# EAGLE design WiFiSensorLTC3566 (EAGLE 7.7.0)
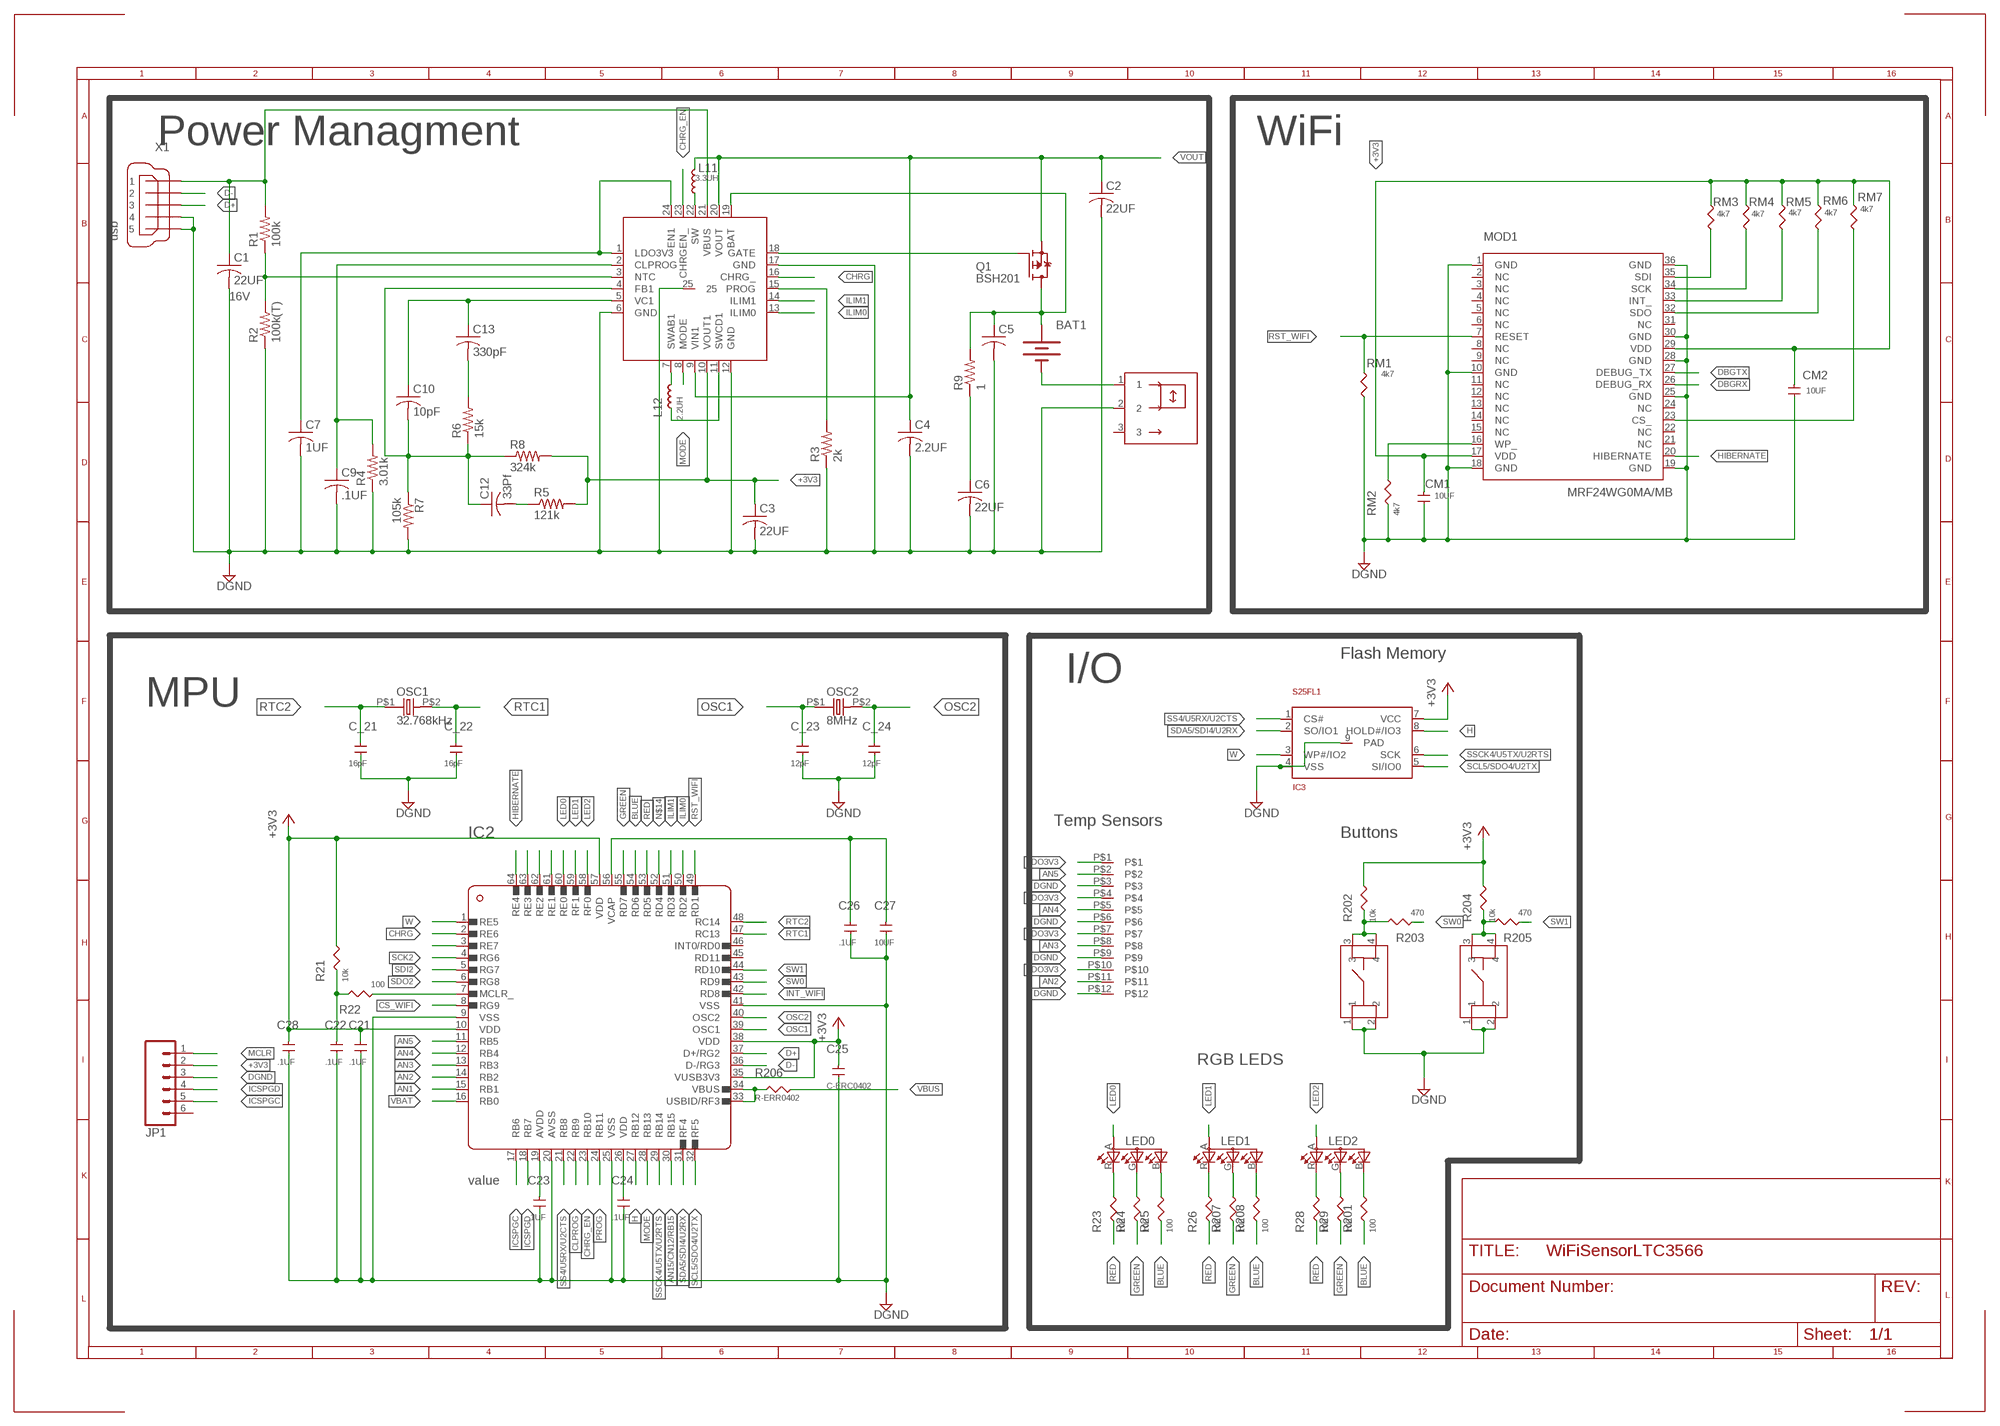
[diagram p0: schematic, sheet 1]

## Parts
BAT1  BATTERY245PTH  [BATTCON_245MM_PTH]
C1  22UF  C-USC0805  [C0805]
C2  22UF  C-USC0805  [C0805]
C3  22UF  C-USC0805  [C0805]
C4  2.2UF  C-USC0805  [C0805]
C5  C-USC0402  [C0402]
C6  22UF  C-USC0805  [C0805]
C7  1UF  C-USC0805  [C0805]
C9  .1UF  C-USC0402  [C0402]
C10  10pF  C-USC0402  [C0402]
C12  33Pf  C-USC0402  [C0402]
C13  330pF  C-USC0402  [C0402]
C21  .1UF  C-ERC0402  [C0402]
C22  .1UF  C-ERC0402  [C0402]
C23  .1UF  C-ERC0402  [C0402]
C24  .1UF  C-ERC0402  [C0402]
C25  C-ERC0402  [C0402]
C26  .1UF  C-ERC0402  [C0402]
C27  10UF  C-ER  [C0805]
C28  .1UF  C-ERC0402  [C0402]
C_21  16pF  C-ERC0402  [C0402]
C_22  16pF  C-ERC0402  [C0402]
C_23  12pF  C-ERC0402  [C0402]
C_24  12pF  C-ERC0402  [C0402]
CM1  10UF  C-ER  [C0805]
CM2  10UF  C-ER  [C0805]
IC1  LTC3566-2  LTC3566  [QFN24-4X4]
IC2  PICMX32695F512H  [TQFP64]
IC3  S25FL1  [8WSON]
JP1  M06LOCK  [1X06_LOCK]
JP2  12_127  [12-127]
L11  3.3UH  L-ERVLCF5020  [VLCF5020]
L12  2.2UH  L-ERVLCF5020  [VLCF5020]
LED0  1X1RGB  [1X1]
LED1  1X1RGB  [1X1]
LED2  1X1RGB  [1X1]
MOD1  MRF24WG0MA/MB  [MRF24]
OSC1  32.768kHz  ECX32  [ECX39]
OSC2  8MHz  CX532  [CX532]
Q1  BSH201  [SOT23]
R1  100k  R-US_R0402  [R0402]
R2  100k(T)  R-US_R0402  [R0402]
R3  2k  R-US_R0402  [R0402]
R4  3.01k  R-US_R0402  [R0402]
R5  121k  R-US_R0402  [R0402]
R6  15k  R-US_R0402  [R0402]
R7  105k  R-US_R0402  [R0402]
R8  324k  R-US_R0402  [R0402]
R9  1  R-US_R0402  [R0402]
R21  10k  R-ERR0402  [R0402]
R22  100  R-ERR0402  [R0402]
R23  100  R-ERR0402  [R0402]
R24  100  R-ERR0402  [R0402]
R25  100  R-ERR0402  [R0402]
R26  100  R-ERR0402  [R0402]
R28  100  R-ERR0402  [R0402]
R29  100  R-ERR0402  [R0402]
R201  100  R-ERR0402  [R0402]
R202  10k  R-ERR0402  [R0402]
R203  470  R-ERR0402  [R0402]
R204  10k  R-ERR0402  [R0402]
R205  470  R-ERR0402  [R0402]
R206  R-ERR0402  [R0402]
R207  100  R-ERR0402  [R0402]
R208  100  R-ERR0402  [R0402]
RM1  4k7  R-ERR0402  [R0402]
RM2  4k7  R-ERR0402  [R0402]
RM3  4k7  R-ERR0402  [R0402]
RM4  4k7  R-ERR0402  [R0402]
RM5  4k7  R-ERR0402  [R0402]
RM6  4k7  R-ERR0402  [R0402]
RM7  4k7  R-ERR0402  [R0402]
SW0  ADTS  [4X5]
SW1  ADTS  [4X5]
SW2  C&K_JS  [SAQN]
X1  usb  MINI-USB-UX60A-MB-5ST  [UX60A-MB-5ST]

## Nets
+3V3: C3.1 C21.2 C24.2 C25.2 C28.2 CM1.2 CM2.2 IC1.10(VOUT1) IC2.10(VDD) IC2.26(VDD) IC2.35(VUSB3V3) IC2.38(VDD) IC2.57(VDD) IC3.7(VCC) JP1.2 MOD1.17(VDD) MOD1.29(VDD) R5.2 R8.2 R21.2 R202.2 R204.2 RM3.2 RM4.2 RM5.2 RM6.2 RM7.2
AN1: IC2.15(RB1)
AN2: IC2.14(RB2) JP2.P$11
AN3: IC2.13(RB3) JP2.P$8
AN4: IC2.12(RB4) JP2.P$5
AN5: IC2.11(RB5) JP2.P$2
AN15/CN12/RB15: IC2.30(RB15)
BLUE: IC2.54(RD6) R25.1 R201.1 R208.1
CHRG: IC1.16(CHRG_) IC2.2(RE6)
CHRG_EN: IC1.23(CHRGEN_) IC2.23(RB10)
CLPROG: C9.1 IC1.2(CLPROG) IC2.22(RB9) R4.2
CS_WIFI: IC2.8(RG9) MOD1.23(CS_) RM7.1
D+: IC2.37(D+/RG2) X1.3
D-: IC2.36(D-/RG3) X1.2
DBGRX: MOD1.26(DEBUG_RX)
DBGTX: MOD1.27(DEBUG_TX)
DGND: C1.2 C2.2 C3.2 C4.2 C5.2 C6.2 C7.2 C9.2 C21.1 C22.1 C23.1 C24.1 C25.1 C26.1 C27.1 C28.1 C_21.1 C_22.1 C_23.1 C_24.1 CM1.1 CM2.1 IC1.6(GND) IC1.12(GND) IC1.17(GND) IC1.25 IC2.9(VSS) IC2.20(AVSS) IC2.25(VSS) IC2.41(VSS) IC3.4(VSS) IC3.9(PAD) JP1.3 JP2.P$3 JP2.P$6 JP2.P$9 JP2.P$12 MOD1.1(GND) MOD1.10(GND) MOD1.18(GND) MOD1.19(GND) MOD1.25(GND) MOD1.28(GND) MOD1.30(GND) MOD1.36(GND) R2.1 R3.1 R4.1 R7.2 RM1.1 RM2.1 SW0.1 SW0.2 SW1.1 SW1.2 SW2.2 X1.4 X1.5
GREEN: IC2.55(RD7) R24.1 R29.1 R207.1
H: IC2.27(RB12) IC3.8(HOLD#/IO3)
HIBERNATE: IC2.64(RE4) MOD1.20(HIBERNATE)
ICSPGC: IC2.17(RB6) JP1.5
ICSPGD: IC2.18(RB7) JP1.4
ILIM0: IC1.13(ILIM0) IC2.50(RD2)
ILIM1: IC1.14(ILIM1) IC2.51(RD3)
INT_WIFI: IC2.42(RD8) MOD1.33(INT_) RM5.1
LDO3V3: C7.1 C23.2 IC1.1(LDO3V3) IC1.24(EN1) IC2.19(AVDD) JP2.P$1 JP2.P$4 JP2.P$7 JP2.P$10
LED0: IC2.60(RE0) LED0.A(A2)
LED1: IC2.59(RF1) LED1.A(A2)
LED2: IC2.58(RF0) LED2.A(A2)
MCLR: C22.2 JP1.1 R21.1 R22.2
MODE: IC1.8(MODE) IC2.28(RB13)
N$1: IC1.22(SW) L11.P$1
N$2: C6.1 R9.1
N$3: IC1.7(SWAB1) L12.P$2
N$4: IC1.11(SWCD1) L12.P$1
N$5: IC2.61(RE1)
N$6: IC2.62(RE2)
N$7: C12.2 R5.1
N$8: IC2.63(RE3)
N$9: IC1.3(NTC) R1.1 R2.2
N$10: C13.2 R6.2
N$12: C10.1 C13.1 IC1.5(VC1)
N$13: C10.2 C12.1 IC1.4(FB1) R6.1 R7.1 R8.1
N$14: IC2.52(RD4)
N$15: BAT1.2(-) SW2.1
N$17: IC1.18(GATE) Q1.1(G)
N$19: IC2.3(RE7)
N$24: IC2.33(USBID/RF3) IC2.34(VBUS) R206.1
N$25: IC2.7(MCLR_) R22.1
N$26: R202.1 R203.2 SW0.3 SW0.4
N$31: C26.2 C27.2 IC2.56(VCAP)
N$33: R204.1 R205.2 SW1.3 SW1.4
N$34: LED0.R(CRED) R23.2
N$40: LED0.G(CBLUE) R24.2
N$41: MOD1.16(WP_) RM2.2
N$42: LED0.B(CGREEN) R25.2
N$43: LED1.R(CRED) R26.2
N$44: LED1.G(CBLUE) R207.2
N$45: LED1.B(CGREEN) R208.2
N$46: LED2.R(CRED) R28.2
N$47: LED2.G(CBLUE) R29.2
N$48: LED2.B(CGREEN) R201.2
OSC1: C_23.2 IC2.39(OSC1) OSC2.P$1
OSC2: C_24.2 IC2.40(OSC2) OSC2.P$2
PROG: IC1.15(PROG) IC2.24(RB11) R3.2
RED: IC2.53(RD5) R23.1 R26.1 R28.1
RST_WIFI: IC2.49(RD1) MOD1.7(RESET) RM1.2
RTC1: C_22.2 IC2.47(RC13) OSC1.P$2
RTC2: C_21.2 IC2.48(RC14) OSC1.P$1
SCK2: IC2.4(RG6) MOD1.34(SCK) RM4.1
SCL5/SDO4/U2TX: IC2.32(RF5) IC3.5(SI/IO0)
SDA5/SDI4/U2RX: IC2.31(RF4) IC3.2(SO/IO1)
SDI2: IC2.5(RG7) MOD1.32(SDO) RM6.1
SDO2: IC2.6(RG8) MOD1.35(SDI) RM3.1
SS4/U5RX/U2CTS: IC2.21(RB8) IC3.1(CS#)
SSCK4/U5TX/U2RTS: IC2.29(RB14) IC3.6(SCK)
SW0: IC2.43(RD9) R203.1
SW1: IC2.44(RD10) R205.1
VBAT: BAT1.3(+) C5.1 IC1.19(BAT) IC2.16(RB0) Q1.3(D) R9.2
VBUS: C1.1 IC1.21(VBUS) R1.2 R206.2 X1.1
VOUT: C2.1 C4.1 IC1.9(VIN1) IC1.20(VOUT) L11.P$2 Q1.2(S)
W: IC2.1(RE5) IC3.3(WP#/IO2)
Unconnected: IC2.45(RD11) IC2.46(INT0/RD0) JP1.6 MOD1.2(NC) MOD1.3(NC) MOD1.4(NC) MOD1.5(NC) MOD1.6(NC) MOD1.8(NC) MOD1.9(NC) MOD1.11(NC) MOD1.12(NC) MOD1.13(NC) MOD1.14(NC) MOD1.15(NC) MOD1.21(NC) MOD1.22(NC) MOD1.24(NC) MOD1.31(NC) SW2.3

## Notes on the sheet
- Power Managment | WiFi
- Flash Memory
- I/O
- MPU
- Temp Sensors
- Buttons
- RGB LEDS

## Library data of the parts
BAT1 = SparkFun:BATTERY: Battery Holders Various common sizes : AA, AAA, 20mm coin cell and 12mm coin cell.
C1 = rcl:C-US: CAPACITOR, American symbol; RESISTANCE: low dc esr; VOLTAGECOEFFECIENT: 16V
C2 = rcl:C-US: CAPACITOR, American symbol; ESR: LOW
C3-C7 C9 C10 C12 C13 = rcl:C-US: CAPACITOR, American symbol
C21-C28 C_21-C_24 CM1 CM2 = rcl:C-ER
IC1 = linear-technology:LTC3566: LTC3566 High Efficiency USB Power Manager Plus 1A Buck-Boost Converter
IC2 = microchip:PICMX32695F512H
IC3 = st-microelectronics:S25FL1
JP1 = SparkFun:M06: Header 6 Standard 6-pin 0.1" header. Use with straight break away headers (SKU : PRT-00116), right angle break away headers (PRT-00553), swiss pins (PRT-00743), machine pins (PRT-00117), and female headers (PRT-00115). Molex polarized connector foot print use with SKU : PRT-08094 with associated crimp pins and housings. NOTES ON THE VARIANTS LOCK and LOCK_LONGPADS... This footprint was designed to help hold the alignment of a through-hole component (i.e. 6-pin header) while soldering it into place. You may notice that each hole has been shifted either up or down by 0.005 of an inch from it's more standard position (which is a perfectly straight line). This slight alteration caused the pins (the squares in the middle) to touch the edges of the holes. Because they are alternating, it causes a "brace" to hold the component in place. 0.005 has proven to be the perfect amount of "off-center" position when using our standard breakaway headers. Although looks a little odd when you look at the bare footprint, once you have a header in there, the alteration is very hard to notice. Also, if you push a header all the way into place, it is covered up entirely on the bottom side. This idea of altering the position of holes to aid alignment will be further integrated into the Sparkfun Library for other footprints. It can help hold any component with 3 or more connection pins.
JP2 = con-molex:12_127
L11 L12 = rcl:L-ER; MAXCURRENT: 2.5A; RESISTANCE: LOW DC
LED0 LED1 LED2 = led:1X1RGB
MOD1 = microchip:MRF24WG0MA/MB
OSC1 = crystal:ECX32; DIGIPART: XC1658CT-ND
OSC2 = crystal:CX532; DIGIPART: XC1658CT-ND
Q1 = transistor-fet:BSH201
R1 = rcl:R-US_: RESISTOR, American symbol; ACCURACY: 1%
R2-R9 = rcl:R-US_: RESISTOR, American symbol
R21-R26 R28 R29 R201-R208 RM1-RM7 = rcl:R-ER
SW0 SW1 = switch:ADTS
SW2 = switch:C&K_JS
X1 = con-hirose:MINI-USB-: MINI USB Connector Source: http://www.hirose.co.jp/cataloge_hp/e24000019.pdf

## Board
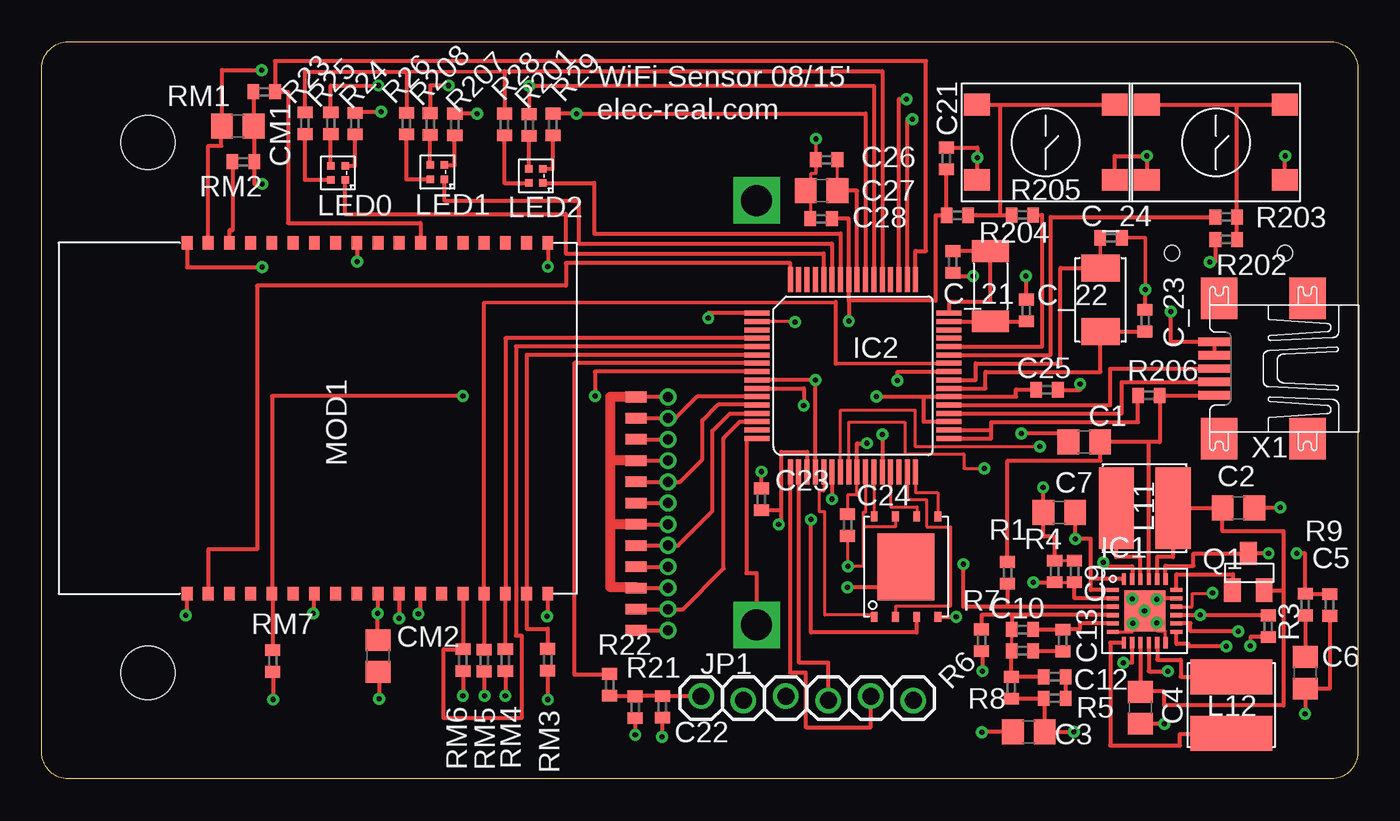
[diagram p1: board, top side]
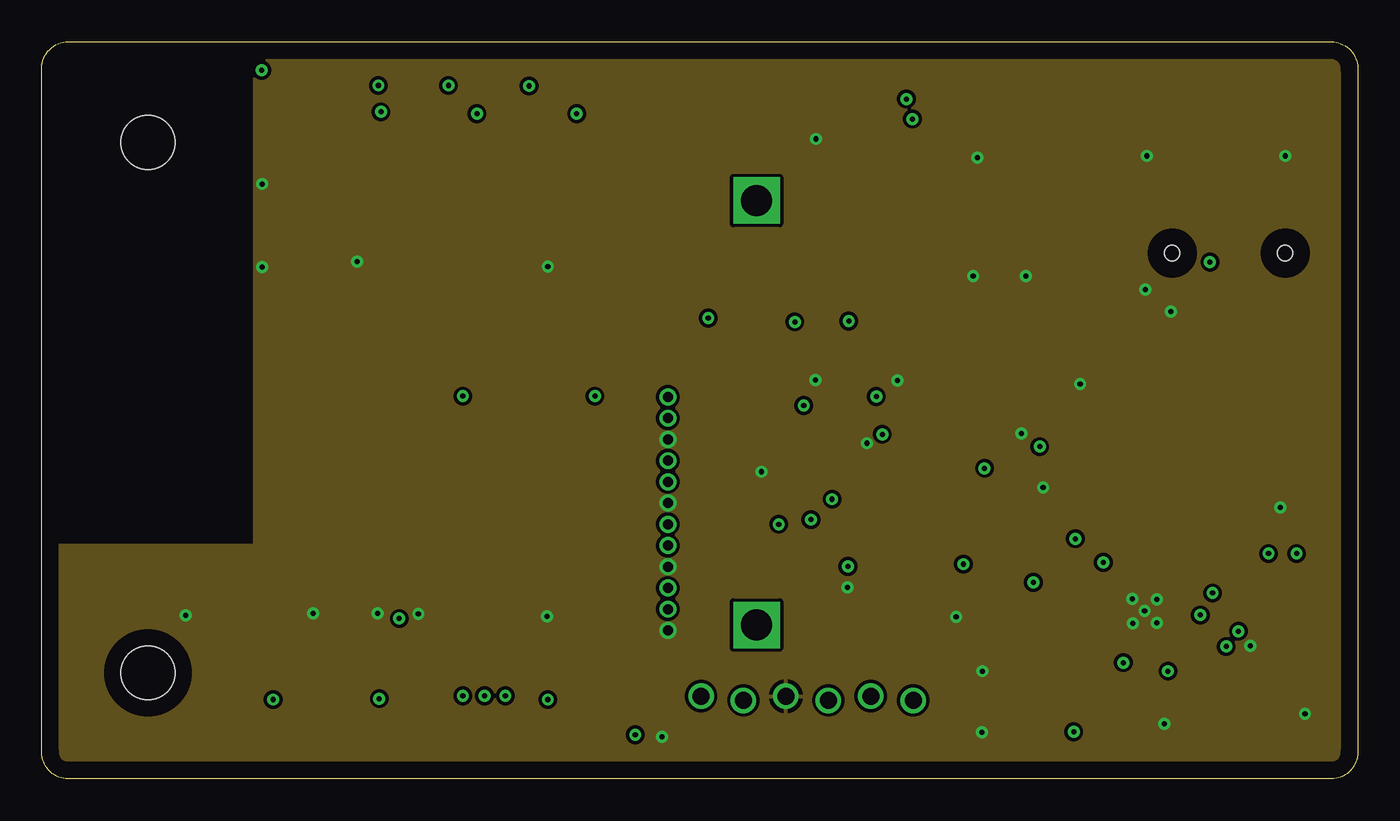
[diagram p2: board, inner layer Route2]
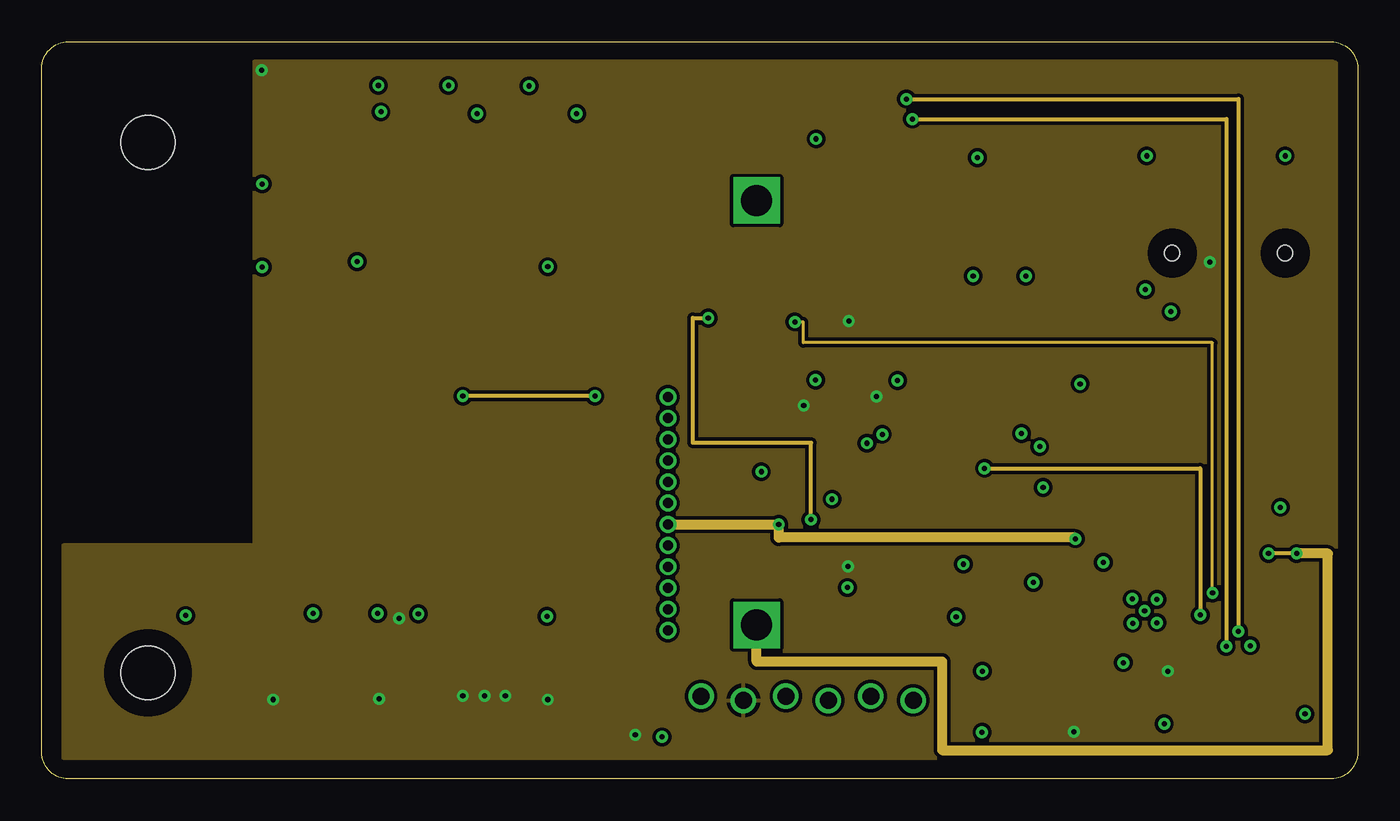
[diagram p3: board, inner layer Route3]
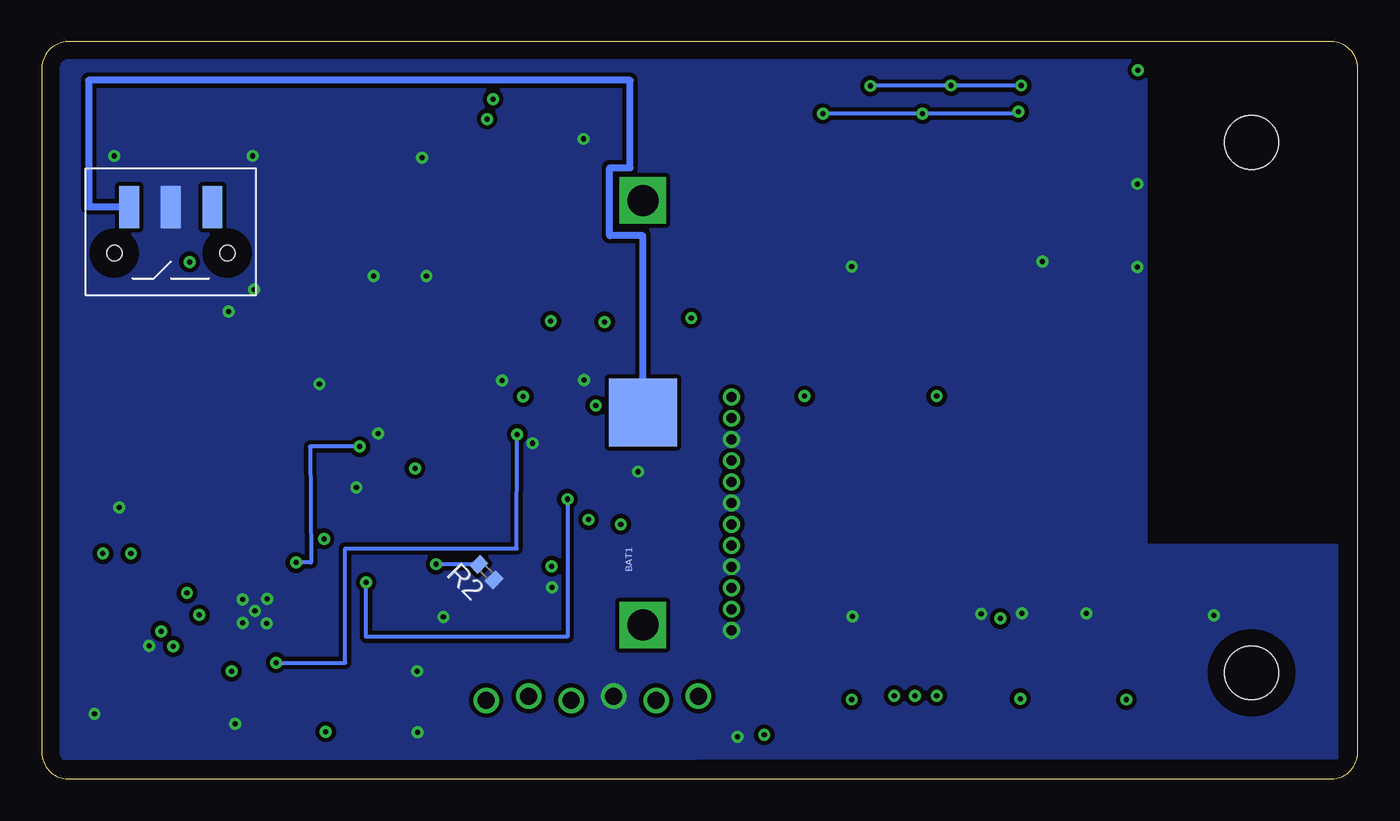
[diagram p4: board, bottom side, seen from below]

Size 78.74 x 44.12 mm. Coordinates in mm from the lower left corner, seen from the top.
Outline: 0,42.53 0,1.59 arc90 1.59,0 77.15,0 arc90 78.74,1.59 78.74,42.53 arc90 77.15,44.12 1.59,44.12 arc90 0,42.53
Outline: 0,42.53 arc0 0,42.53
Outline: 0,42.53 0,42.53
Copper layers (1*2+3*16): Top 0.035mm / dielectric 0.5mm / Route2 0.035mm / dielectric 0.5mm / Route3 0.035mm / dielectric 0.5mm / Bottom 0.035mm
Design rules "default *": minimum track width 7mil, minimum drill 12mil, track to track 8mil, track to pad 7mil, pad to pad 7mil, via to via 8mil, smd to smd 7mil, copper to edge 40mil, drill to drill 20mil, minimum pad ring 10mil, minimum via ring 8mil, stop-mask expansion 4mil, vias tented up to drill 0mil, thermal gap 10mil
Holes 3.2 mm at 6.35,38.1 6.35,6.35

### Footprints (pad centres in the part's own frame; a part is rotated, then mirrored left to right if it is on the bottom)
BATTCON_245MM_PTH = drill 1.854 square: 1 12.7,0; 3 -12.7,0 | smd 4.064 x 4.064: 2 0,0
C0805 = smd 1.3 x 1.5: 1 -0.95,0; 2 0.95,0
C0402 = smd 0.7 x 0.9: 1 -0.65,0; 2 0.65,0
QFN24-4X4 = smd 0.7 x 0.25: 1 -1.9,1.25; 2 -1.9,0.75; 3 -1.9,0.25; 4 -1.9,-0.25; 5 -1.9,-0.75; 6 -1.9,-1.25; 13 1.9,-1.25; 14 1.9,-0.75; 15 1.9,-0.25; 16 1.9,0.25; 17 1.9,0.75; 18 1.9,1.25 | smd 0.25 x 0.7: 7 -1.25,-1.9; 8 -0.75,-1.9; 9 -0.25,-1.9; 10 0.25,-1.9; 11 0.75,-1.9; 12 1.25,-1.9; 19 1.25,1.9; 20 0.75,1.9; 21 0.25,1.9; 22 -0.25,1.9; 23 -0.75,1.9; 24 -1.25,1.9 | smd 2.45 x 2.45: 25 0,0
TQFP64 = smd 1.5 x 0.3: 1 -5.75,3.75; 2 -5.75,3.25; 3 -5.75,2.75; 4 -5.75,2.25; 5 -5.75,1.75; 6 -5.75,1.25; 7 -5.75,0.75; 8 -5.75,0.25; 9 -5.75,-0.25; 10 -5.75,-0.75; 11 -5.75,-1.25; 12 -5.75,-1.75; 13 -5.75,-2.25; 14 -5.75,-2.75; 15 -5.75,-3.25; 16 -5.75,-3.75; 33 5.75,-3.75; 34 5.75,-3.25; 35 5.75,-2.75; 36 5.75,-2.25; 37 5.75,-1.75; 38 5.75,-1.25; 39 5.75,-0.75; 40 5.75,-0.25; 41 5.75,0.25; 42 5.75,0.75; 43 5.75,1.25; 44 5.75,1.75; 45 5.75,2.25; 46 5.75,2.75; 47 5.75,3.25; 48 5.75,3.75 | smd 0.3 x 1.5: 17 -3.75,-5.75; 18 -3.25,-5.75; 19 -2.75,-5.75; 20 -2.25,-5.75; 21 -1.75,-5.75; 22 -1.25,-5.75; 23 -0.75,-5.75; 24 -0.25,-5.75; 25 0.25,-5.75; 26 0.75,-5.75; 27 1.25,-5.75; 28 1.75,-5.75; 29 2.25,-5.75; 30 2.75,-5.75; 31 3.25,-5.75; 32 3.75,-5.75; 49 3.75,5.75; 50 3.25,5.75; 51 2.75,5.75; 52 2.25,5.75; 53 1.75,5.75; 54 1.25,5.75; 55 0.75,5.75; 56 0.25,5.75; 57 -0.25,5.75; 58 -0.75,5.75; 59 -1.25,5.75; 60 -1.75,5.75; 61 -2.25,5.75; 62 -2.75,5.75; 63 -3.25,5.75; 64 -3.75,5.75
8WSON = smd 0.6 x 0.4: 1 -3,1.905; 2 -3,0.635; 3 -3,-0.635; 4 -3,-1.905; 5 3,-1.905; 6 3,-0.635; 7 3,0.635; 8 3,1.905 | smd 4 x 3.4: 9 0,0
1X06_LOCK = drill 1.016: 1 0,0; 2 2.54,-0.254; 3 5.08,0; 4 7.62,-0.254; 5 10.16,0; 6 12.7,-0.254
12-127 = smd 0.635 x 1.27: P$1 -6.985,0; P$2 -5.715,0; P$3 -4.445,0; P$4 -3.175,0; P$5 -1.905,0; P$6 -0.635,0; P$7 0.635,0; P$8 1.905,0; P$9 3.175,0; P$10 4.445,0; P$11 5.715,0; P$12 6.985,0
VLCF5020 = smd 4.9 x 2.1: P$1 0,-1.7; P$2 0,1.7
1X1 = smd 0.45 x 0.45: A 0.425,0.425; B -0.425,-0.425; G -0.425,0.425; R 0.425,-0.425
MRF24 = smd 0.8 x 0.65: 1 -10.5,13.77; 2 -10.5,12.5; 3 -10.5,11.23; 4 -10.5,9.96; 5 -10.5,8.69; 6 -10.5,7.42; 7 -10.5,6.15; 8 -10.5,4.88; 9 -10.5,3.61; 10 -10.5,2.34; 11 -10.5,1.07; 12 -10.5,-0.2; 13 -10.5,-1.47; 14 -10.5,-2.74; 15 -10.5,-4.01; 16 -10.5,-5.28; 17 -10.5,-6.55; 18 -10.5,-7.82; 19 10.5,-7.82; 20 10.5,-6.55; 21 10.5,-5.28; 22 10.5,-4.01; 23 10.5,-2.74; 24 10.5,-1.47; 25 10.5,-0.2; 26 10.5,1.07; 27 10.5,2.34; 28 10.5,3.61; 29 10.5,4.88; 30 10.5,6.15; 31 10.5,7.42; 32 10.5,8.69; 33 10.5,9.96; 34 10.5,11.23; 35 10.5,12.5; 36 10.5,13.77
ECX39 = smd 1.3 x 2.2: P$1 -2.1,0; P$2 2.1,0
CX532 = smd 1.6 x 2.3: P$1 -1.9,0; P$2 1.9,0
SOT23 = smd 1 x 1.4: 1 -0.95,-1.1; 2 0.95,-1.1; 3 0,1.1
R0402 = smd 0.7 x 0.9: 1 -0.65,0; 2 0.65,0
4X5 = smd 1.55 x 1.3: 1 -4.125,2.25; 2 4.125,2.25; 3 -4.125,-2.25; 4 4.125,-2.25
SAQN = smd 1.194 x 2.515: 1 -2.489,2.743; 2 0,2.743; 3 2.489,2.743 | hole 0.9: -3.378,0; 3.378,0
UX60A-MB-5ST = smd 2 x 0.5: 1 2.25,1.6; 2 2.25,0.8; 3 2.25,0; 4 2.25,-0.8; 5 2.25,-1.6 | smd 2.2 x 2.5: M1 -3.3,-4.2; M2 -3.3,4.2; M3 2,4.2; M4 2,-4.2

### Placement (x,y rotation side)
BAT1  42.77,21.92 90 bottom
C1  62.38,20.17 180 top
C2  71.6,16.23 0 top
C3  59.06,2.82 180 top
C4  65.74,4.27 270 top
C5  77.06,10.41 270 top
C6  75.59,6.35 270 top
C7  60.88,15.95 180 top
C9  61.8,12.42 90 top
C10  58.67,8.94 180 top
C12  60.6,6.12 0 top
C13  61.09,8.28 270 top
C21  54.13,37.13 270 top
C22  37.13,4.32 90 top
C23  43.05,16.74 270 top
C24  48.21,15.19 270 top
C25  60.15,23.29 180 top
C26  46.96,37.06 0 top
C27  46.66,35.2 0 top
C28  46.63,33.53 0 top
C_21  54.51,30.94 90 top
C_22  58.9,28.04 270 top
C_23  66.01,27.43 270 top
C_24  63.98,32.38 180 top
CM1  11.73,39.07 180 top
CM2  20.12,7.37 270 top
IC1  65.99,10.06 0 top
IC2  48.54,24.13 0 top
IC3  51.71,12.7 90 top
JP1  39.45,4.95 0 top
JP2  35.56,15.88 270 top
L11  65.99,16.21 270 top
L12  71.17,4.42 180 top
LED0  17.73,36.27 270 top
LED1  23.67,36.32 270 top
LED2  29.57,36.09 270 top
MOD1  16.51,21.59 270 top
OSC1  56.77,29.49 270 top
OSC2  63.35,28.68 90 top
Q1  72.19,12.4 0 top
R1  57.79,12.34 90 top
R2  52.13,12.38 135 bottom
R3  73.38,9.14 90 top
R4  60.6,12.42 270 top
R5  60.6,4.83 180 top
R6  58.67,7.67 0 top
R7  56.24,8.31 270 top
R8  58.01,5.46 270 top
R9  75.59,10.44 90 top
R21  35.51,4.29 270 top
R22  33.99,5.64 270 top
R23  15.75,39.24 270 top
R24  18.75,39.22 270 top
R25  17.3,39.24 270 top
R26  21.82,39.22 270 top
R28  27.69,39.17 270 top
R29  30.58,39.17 270 top
R201  29.16,39.14 270 top
R202  70.87,32.28 180 top
R203  70.87,33.63 0 top
R204  54.79,33.73 180 top
R205  58.67,33.76 180 top
R206  66.24,22.96 0 top
R207  24.71,39.17 270 top
R208  23.24,39.19 270 top
RM1  13.31,41.12 0 top
RM2  12.07,36.93 180 top
RM3  30.28,7.14 270 top
RM4  27.74,7.11 270 top
RM5  26.47,7.09 270 top
RM6  25.2,7.11 270 top
RM7  13.82,7.06 270 top
SW0  70.26,38.1 180 top
SW1  60.07,38.1 180 top
SW2  71.02,31.47 0 bottom
X1  72.44,24.56 180 top

### Tracks (layer width: path | path; a pad name or v marks a point on that pad's centre or on a via)
+3V3  (via drill 0.3)
  Top 0.178: 49.15,15.09 49.15,15.95 49.29,15.95 IC2.26 | 49.15,15.09 49.15,12.72 v48.24,12.72 48.24,14.54 C24.2 | IC3.7 51.08,15.09 49.15,15.09
  Top 0.254: C28.2 48.29,33.53 IC2.57 48.29,28.63 | IC2.38 54.29,22.86 | IC2.38 58.29,22.88 58.29,23.32 59.5,23.32 C25.2 | 48.29,28.63 53.49,28.63 53.49,33.73 R204.2 54.13,33.73 C21.2 54.13,36.5 | 52.76,22.89 52.76,21.38 IC2.35 | 52.76,22.89 IC2.38 | v49.94,22.89 52.76,22.89 | 48.29,28.63 v48.29,27.41 | 20.12,6.4 CM2.2 20.19,6.42 v20.19,4.8 | IC1.10 66.24,6.45 v67.39,6.45 | v61.75,2.82 C3.1 60.01,4.83 R5.2 59.95,4.81 R8.2 | IC2.10 45.59,23.38 v45.59,22.35 | RM3.2 v30.28,4.75 | RM4.2 v27.74,4.98 | RM5.2 26.47,4.98 v26.49,4.98 | RM6.2 v25.2,4.98 | RM7.2 13.84,6.41 v13.84,4.75 | MOD1.29 v21.39,9.6 | R21.2 v35.51,2.64 | R202.2 70.22,30.94 v69.9,30.94 | v13.16,42.42 10.79,42.42 CM1.2 10.74,39.06 10.74,37.9 9.96,37.9 MOD1.17
  pour Route3: 1.27,1.27 77.47,1.27 77.47,42.67 77.47,42.93 12.7,42.93 12.7,13.97 1.27,13.97
AN2  (via drill 0.6)
  Top 0.254: JP2.P$11 v37.47,10.16 38.35,10.16 40.79,12.6 40.79,20.4 41.78,21.38 IC2.14
AN3  (via drill 0.6)
  Top 0.254: JP2.P$8 v37.47,13.97 38.08,13.97 40.13,16.03 40.13,20.83 41.17,21.87 IC2.13
AN4  (via drill 0.6)
  Top 0.254: JP2.P$5 v37.47,17.78 38.18,17.78 39.52,19.13 39.52,21.46 40.46,22.4 42.79,22.4 IC2.12
AN5  (via drill 0.6)
  Top 0.254: JP2.P$2 v37.47,21.59 37.92,21.59 39.21,22.88 IC2.11
BLUE  (via drill 0.3)
  Top 0.254: R201.1 v29.16,41.48 49.79,41.48 IC2.54 | R25.1 17.3,41.5 v20.14,41.5 | R208.1 23.24,41.5 v24.33,41.5
  Bottom 0.254: v29.16,41.48 24.33,41.48 v24.33,41.5 v20.14,41.5
CHRG  (via drill 0.3)
  Top 0.178: IC1.16 68.83,10.31 68.83,11.1 70.05,11.1 v70.05,11.12 | v45.06,27.36 45.06,27.38 IC2.2
  Route3 0.178: v70.05,11.12 70.05,26.11 45.57,26.11 45.57,27.36 v45.06,27.36
CHRG_EN  (via drill 0.3)
  Top 0.178: IC2.23 47.79,22.07 52.25,22.07 52.25,19.89 v59.72,19.89
  Top 0.254: v63.53,12.95 63.53,12.72 65.25,12.72 65.25,11.96 IC1.23
  Bottom 0.254: v59.72,19.89 62.69,19.89 62.64,12.95 v63.53,12.95
CLPROG  (via drill 0.3)
  Top 0.178: R4.2 C9.1
  Top 0.254: IC1.2 61.8,10.81 C9.1 | IC2.22 v47.29,16.74 | v59.33,11.76 R4.2
  Bottom 0.254: v47.29,16.74 47.29,8.51 59.33,8.51 v59.33,11.76
CS_WIFI  (via drill 0.3)
  Top 0.254: RM7.1 13.82,11.09 MOD1.23 13.77,22.91 v25.2,22.91 | IC2.8 33.1,24.38 v33.1,22.91
  Route3 0.254: v33.1,22.91 v25.2,22.91
D+
  Top 0.254: X1.3 63.93,24.56 63.93,22.38 IC2.37
D-
  Top 0.254: IC2.36 64.62,21.88 64.62,23.75 70.19,23.75 X1.2
DGND  (via drill 0.3, 0.6)
  Top 0.178: C28.1 45.98,34.93 C27.1 | 45.98,35.2 46.03,35.24 46.03,36.25 46.32,36.25 | IC1.12 67.24,8.84 66.73,8.84 v66.73,9.35 | C24.1 48.21,16.99 48.79,16.99 IC2.25 | IC1.6 65.28,8.81 v65.28,9.32 | R4.1 C9.2
  Top 0.203: 20.12,8.02 CM2.1 20.09,8.02 | C_24.1 66.04,32.38 v66.04,29.29 | v46.33,38.3 46.33,37.06 C26.1 46.32,36.25
  Top 0.254: MOD1.19 8.69,9.78 v8.61,9.78 8.66,9.78 | MOD1.25 16.31,9.91 v16.23,9.91 | MOD1.28 20.12,9.91 v20.09,9.91 20.09,8.02 | MOD1.36 30.28,9.73 v30.23,9.73 | MOD1.30 22.66,9.88 v22.53,9.88 | C27.1 45.98,35.2 | MOD1.1 v30.28,30.66 | C25.1 62.13,23.29 v62.13,23.65 | MOD1.10 18.87,32.09 v18.87,30.96 | IC2.9 45.31,23.88 v46.3,23.88 46.3,18.38 IC2.20 | IC2.41 51.21,24.38 v51.21,23.85 | C_23.1 66.04,28.08 v66.04,29.29 | C_21.1 54.51,30.1 v55.73,30.1 | C_22.1 58.9,30.1 v58.88,30.1 | IC1.17 65.99,10.81 IC1.25 | v67.56,27.96 67.56,26.16 X1.5 X1.4 | SW1.2 55.98,35.85 v55.98,37.19 55.98,37.78 C21.1 | SW1.1 64.2,37.29 v66.12,37.29 66.12,35.85 SW0.2 | SW0.1 74.38,37.29 v74.4,37.29 | IC2.25 48.79,20.09 v49.38,20.09 | C2.2 arc-90 72.58,16.26 v74.12,16.26 | R7.2 56.29,7.66 v56.29,6.45 | C3.2 56.26,2.82 v56.26,2.79 | C4.2 67.16,3.32 v67.16,3.3 | C22.1 37.11,3.67 v37.11,2.52 | JP2.P$3 v37.47,20.32 | JP2.P$6 v37.47,16.51 | JP2.P$9 v37.47,12.7 | JP2.P$12 v37.47,8.89 | v75.59,3.89 C6.2 77.06,5.4 C5.2 | IC3.4 v54.71,9.7 | C23.1 v43.05,18.39 | IC3.9 51.71,11.46 v48.21,11.46 | R3.1 72.31,8.49 v72.31,7.98 | RM1.1 12.69,41.12 CM1.1 12.72,39.06 RM2.1 12.72,35.61 v13.18,35.61 | MOD1.18 8.69,30.63 v13.18,30.63 | C1.2 61.43,20.68 v58.62,20.68 | R4.1 60.6,14.5 59.94,14.5 59.94,15.95 C7.2 59.93,17.45 v59.92,17.45
  other vias: 65.99,10.06 65.25,10.77 66.73,10.74
  pour Bottom (isolate 0.254, no thermals): 1.27,1.27 77.75,1.19 77.62,43.03 12.7,43.18 12.7,13.97 1.27,13.97
  pour Route2: 0,0 78.74,0 78.74,43.94 12.7,43.94 12.7,13.97 0,13.97
GREEN  (via drill 0.3)
  Top 0.254: R29.1 v32,39.82 49.29,39.82 IC2.55 | R24.1 18.75,39.93 v20.3,39.93 | v26.04,39.82 R207.1
  Bottom 0.254: v20.3,39.93 20.3,39.82 v26.04,39.82 v32,39.82
H
  Top 0.178: IC2.27 49.79,15.7 IC3.8
HIBERNATE
  Top 0.254: IC2.64 44.79,30.86 31.37,30.86 31.37,29.52 12.88,29.52 12.88,13.74 9.96,13.74 MOD1.20
ICSPGC
  Top 0.254: IC2.17 44.79,6.35 45.72,6.35 45.72,3.1 49.61,3.1 JP1.5
ICSPGD
  Top 0.254: JP1.4 47.07,6.96 45.31,6.96 45.31,18.38 IC2.18
ILIM0  (via drill 0.3)
  Top 0.254: IC2.50 51.79,39.5 v52.1,39.5 | v70.87,7.92 68.58,7.92 68.61,8.08 67.89,8.08 IC1.13
  Route3 0.254: v52.1,39.5 70.89,39.5 v70.87,7.92
ILIM1  (via drill 0.3)
  Top 0.254: IC2.51 51.29,40.69 v51.74,40.69 | v71.6,8.84 68.73,8.84 68.73,9.32 67.89,9.32 IC1.14
  Route3 0.254: v51.74,40.69 71.6,40.69 v71.6,8.84
INT_WIFI
  Top 0.254: IC2.42 47.5,24.86 47.5,28.55 26.47,28.5 MOD1.33 RM5.1
LDO3V3  (via drill 0.3, 0.6)
  Top 0.254: JP2.P$4 v37.47,19.05 | JP2.P$7 v37.47,15.24 | v37.47,22.86 JP2.P$1 | C7.1 61.85,15.95 v61.85,14.38 62.76,14.38 62.76,11.96 | 64.74,11.94 IC1.24 62.76,11.96 | IC1.1 62.76,11.31 62.76,11.96 | C23.2 44.25,16.09 | 44.25,16.09 44.25,19.58 45.79,19.58 IC2.19 | v44.09,15.24 44.25,15.24 44.25,16.09 | JP2.P$10 v37.47,11.43
  Top 0.61: JP2.P$1 34.01,22.86 34.01,19.05 | 34.01,19.05 34.01,15.24 | 34.01,15.24 34.01,11.48 35.56,11.48 JP2.P$10 | JP2.P$4 34.01,19.05 | JP2.P$7 34.01,15.24
  Route3 0.61: v37.47,15.24 v44.09,15.24 44.09,14.45 61.85,14.45 v61.85,14.38
LED0
  Top 0.254: LED0.A 18.15,33.81 31.34,33.81 31.34,31.45 46.79,31.45 IC2.60
LED1
  Top 0.254: LED1.A 24.1,34.62 32.13,34.62 32.13,32.05 47.27,32.05 47.27,29.88 IC2.59
LED2
  Top 0.254: LED2.A 33.05,35.67 33.05,32.64 47.79,32.64 IC2.58
MCLR
  Top 0.254: JP1.1 37.14,4.95 C22.2 35.51,4.97 R21.1 33.99,4.94 R22.2
MODE  (via drill 0.3)
  Top 0.254: IC1.8 65.24,6.96 v64.72,6.96 | v50.29,20.62 IC2.28
  Bottom 0.254: v64.72,6.96 60.58,6.96 60.58,13.79 50.32,13.79 50.29,20.6 v50.29,20.62
N$1
  Top 0.254: IC1.22 65.74,13.28 64.29,13.28 L11.P$1
N$2
  Top 0.254: R9.1 C6.1
N$3
  Top 0.254: IC1.7 63.93,8.16 63.93,2.01 68.1,2.01 68.1,2.69 71.17,2.69 L12.P$2
N$4
  Top 0.254: IC1.11 66.74,7.14 68.15,7.14 68.15,6.12 L12.P$1
N$7
  Top 0.254: C12.2 R5.1
N$9  (via drill 0.3)
  Top 0.254: IC1.3 57.79,10.31 | 57.79,10.31 55.14,10.31 v55.14,12.85 | R1.1 57.79,10.31
  Bottom 0.254: R2.2 52.59,12.85 v55.14,12.85
N$10
  Top 0.254: C13.2 59.32,7.63 R6.2
N$12
  Top 0.254: IC1.5 62.1,9.31 62.1,8.94 61.09,8.94 C13.1 C10.1
N$13
  Top 0.178: C10.2 R6.1
  Top 0.254: 58.06,7.67 R6.1 58.02,6.11 R8.1 58.01,6.12 C12.1 | IC1.4 58.09,9.81 | 58.09,9.81 56.24,9.81 R7.1 | C10.2 58.09,8.94 58.09,9.81
N$15
  Bottom 0.406: BAT1.2 42.77,32.51 44.76,32.51 44.76,36.58 43.54,36.58 43.54,41.81 75.95,41.81 75.95,34.24 73.51,34.24 SW2.1
N$17
  Top 0.254: IC1.18 67.89,12.24 71.27,12.24 71.27,11.29 Q1.1
N$24
  Top 0.254: IC2.34 arc-90 IC2.34 56.82,20.88 | 56.82,20.88 56.82,21.36 65.59,21.36 R206.1 | IC2.33 56.82,20.38 56.82,20.88
N$25
  Top 0.254: IC2.7 31.85,24.88 31.85,6.25 33.99,6.25 R22.1
N$26
  Top 0.254: SW0.4 71.5,40.35 71.52,40.35 | 71.52,40.35 SW0.3 | R202.1 R203.2 71.52,40.35
N$31
  Top 0.178: C27.2 C26.2
  Top 0.254: C27.2 48.79,35.2 IC2.56
N$33
  Top 0.254: SW1.4 57.35,40.35 | 57.35,40.35 SW1.3 | R204.1 55.9,33.76 57.35,33.76 | 57.35,33.76 R205.2 | 57.35,33.76 57.35,40.35
N$34
  Top 0.254: LED0.R 15.75,35.85 R23.2
N$40
  Top 0.254: LED0.G 18.75,36.7 R24.2
N$41
  Top 0.254: RM2.2 11.42,32.84 11.23,32.84 MOD1.16
N$42
  Top 0.254: LED0.B R25.2
N$43
  Top 0.254: LED1.R 21.82,35.9 R26.2
N$44
  Top 0.254: LED1.G 24.71,36.75 R207.2
N$45
  Top 0.254: R208.2 LED1.B
N$46
  Top 0.254: LED2.R 27.69,35.67 R28.2
N$47
  Top 0.254: LED2.G 30.58,36.52 R29.2
N$48
  Top 0.254: LED2.B 29.16,36.52 R201.2
OSC1
  Top 0.254: IC2.39 56.46,23.38 56.46,24.36 63.35,24.36 OSC2.P$1 C_23.2
OSC2
  Top 0.203: 63.35,30.6 63.35,32.38 C_24.2
  Top 0.254: IC2.40 55.88,23.88 55.88,24.87 60.96,24.87 60.96,30.58 OSC2.P$2 63.35,30.6
PROG  (via drill 0.3)
  Top 0.178: IC2.24 48.29,21.36 51.64,21.36 51.64,19.46 55.17,19.46 55.17,18.59 v56.41,18.59
  Top 0.254: IC1.15 v69.32,9.81 73.38,9.81 R3.2
  Route3 0.254: v56.41,18.59 69.32,18.59 v69.32,9.81
RED
  Top 0.254: 27.69,42.37 R28.1 | IC2.53 50.29,42.37 27.69,42.37 | R23.1 15.75,42.34 21.82,42.34 | 21.82,42.34 27.69,42.37 | 21.82,42.34 R26.1
RST_WIFI
  Top 0.254: MOD1.7 22.66,33.27 14.73,33.27 14.73,41.12 RM1.2 13.96,42.98 52.91,42.98 52.91,31.6 52.29,31.6 IC2.49
RTC1
  Top 0.254: IC2.47 OSC1.P$2 C_22.2
RTC2
  Top 0.254: C_21.2 OSC1.P$1 56.77,28.57 54.31,28.57 54.31,27.88 IC2.48
SCK2
  Top 0.254: IC2.4 27.74,26.38 MOD1.34 RM4.1
SCL5/SDO4/U2TX
  Top 0.178: IC2.32 52.29,17.14 53.62,17.14 IC3.5
SDA5/SDI4/U2RX
  Top 0.178: IC2.31 51.79,16.71 52.93,16.71 52.93,15.09 54.38,15.09 54.38,10.34 51.08,10.34 IC3.2
SDI2
  Top 0.254: IC2.5 28.37,25.88 28.37,8.59 28.7,8.59 28.7,3.63 24.05,3.63 24.05,7.76 RM6.1 MOD1.32
SDO2
  Top 0.254: IC2.6 29.01,25.38 MOD1.35 29.01,8.99 30.28,8.99 RM3.1
SS4/U5RX/U2CTS
  Top 0.178: IC3.1 49.81,9.8 46.84,9.8 46.84,16 46.51,16 46.51,17.22 46.79,17.22 IC2.21 46.76,18.38
SSCK4/U5TX/U2RTS
  Top 0.178: IC2.29 50.79,16.28 52.38,16.28 52.38,15.7 IC3.6
SW0
  Top 0.254: IC2.43 60.38,25.38 60.38,33.63 R203.1
SW1
  Top 0.254: IC2.44 59.87,25.88 59.87,33.76 R205.1
VBAT  (via drill 0.3)
  Top 0.254: 42.77,20.38 IC2.16 42.16,20.38 42.16,12.32 42.77,12.32 BAT1.3 | v75.08,13.49 75.59,13.49 R9.2 75.59,11.06 C5.1 | v73.41,13.49 72.62,13.49 Q1.3 68.91,13.49 68.91,12.75 67.24,12.75 IC1.19
  Route3 0.254: v75.08,13.49 v73.41,13.49
  Route3 0.61: v75.08,13.49 76.96,13.49 76.96,1.73 53.87,1.73 53.87,7.04 42.77,7.04 BAT1.3
VBUS
  Top 0.254: IC1.21 66.24,20.16 | R206.2 | R206.2 X1.1 | R206.2 66.89,20.16 66.24,20.16 | 66.24,20.16 66.24,20.17 C1.1 63.35,20.17 63.35,19.05 57.79,19.05 R1.2
VOUT
  Top 0.254: IC1.9 C4.1 65.74,5.23 67.16,5.23 67.16,4.39 74.3,4.39 74.3,11.29 | IC1.20 66.73,11.96 66.73,13.28 67.69,13.28 L11.P$2 70.65,16.2 C2.1 70.65,14.83 74.3,14.83 74.3,11.29 | Q1.2 74.3,11.29
W  (via drill 0.3)
  Top 0.254: IC3.3 52.35,8.76 46.03,8.76 v46.03,15.52 | IC2.1 39.88,27.88 v39.88,27.58
  Route3 0.254: v46.03,15.52 46.03,20.12 38.96,20.12 38.96,27.58 v39.88,27.58

### Text on the board
tPlace: WiFi Sensor 08/15' | elec-real.com